# Altium schematic sheet configuration.SchDoc
size A4
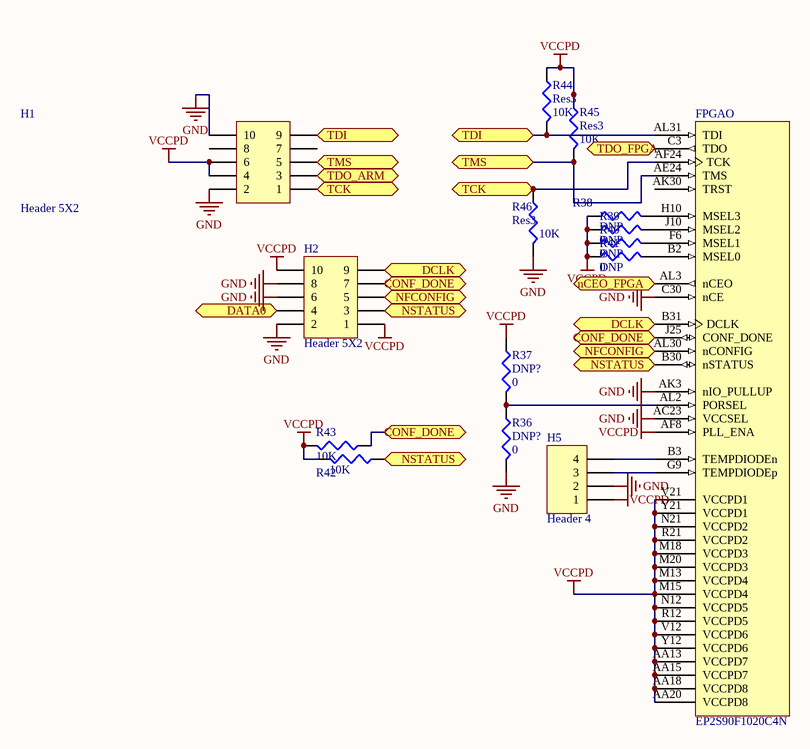
[diagram p0: configuration.SchDoc]

## Parts
FPGA  EP2S90F1020C4N  [FBGA1020]  (part O of 18)
H1  Header 5X2  [HDR2X5]
H2  Header 5X2  [HDR2X5]
H5  Header 4  [HDR1X4]
R36  DNP?  value 0  [RESC1608L]
R37  DNP?  value 0  [RESC1608L]
R38  DNP  value 0  [RESC1608L]
R39  DNP  value 0  [RESC1608L]
R40  DNP  value 0  [RESC1608L]
R41  DNP  value 0  [RESC1608L]
R42  value 10K  [RESC1608L]
R43  value 10K  [RESC1608L]
R44  Res3  value 10K  [RESC1608L]
R45  Res3  value 10K  [RESC1608L]
R46  Res3  value 10K  [RESC1608L]

## Ports
CONF_DONE, DATA0, DCLK, nCEO_FPGA, NFCONFIG, NSTATUS, TCK, TDI, TDO_ARM, TDO_FPGA, TMS

## Nets
GND: FPGA.AC23(VCCSEL) FPGA.AK3(nIO_PULLUP) FPGA.C30(nCE) H1.2 H1.10 H2.2 H2.6 H2.8 H5.2 R36.2 R46.2
VCCPD: FPGA.AA13(VCCPD7) FPGA.AA15(VCCPD7) FPGA.AA18(VCCPD8) FPGA.AA20(VCCPD8) FPGA.AF8(PLL_ENA) FPGA.M13(VCCPD4) FPGA.M15(VCCPD4) FPGA.M18(VCCPD3) FPGA.M20(VCCPD3) FPGA.N12(VCCPD5) FPGA.N21(VCCPD2) FPGA.R12(VCCPD5) FPGA.R21(VCCPD2) FPGA.V12(VCCPD6) FPGA.V21(VCCPD1) FPGA.Y12(VCCPD6) FPGA.Y21(VCCPD1) H1.4 H1.6 H2.1 H2.10 H5.1 R37.1 R38.1 R39.1 R40.1 R41.1 R42.2 R43.2 R44.1 R45.1
CONF_DONE: FPGA.J25(CONF_DONE) H2.7 R43.1 ; port CONF_DONE
DATA0: H2.4 ; port DATA0
DCLK: FPGA.B31(DCLK) H2.9 ; port DCLK
nCEO_FPGA: FPGA.AL3(nCEO) ; port nCEO_FPGA
NFCONFIG: FPGA.AL30(nCONFIG) H2.5 ; port NFCONFIG
NSTATUS: FPGA.B30(nSTATUS) H2.3 R42.1 ; port NSTATUS
TCK: FPGA.AF24(TCK) H1.1 R46.1 ; port TCK
TDI: FPGA.AL31(TDI) H1.9 R44.2 ; port TDI
TDO_ARM: H1.3 ; port TDO_ARM
TDO_FPGA: FPGA.C3(TDO) ; port TDO_FPGA
TMS: FPGA.AE24(TMS) H1.5 R45.2 ; port TMS
NetFPGA_AL2: FPGA.AL2(PORSEL) R36.1 R37.2
NetFPGA_B2: FPGA.B2(MSEL0) R41.2
NetFPGA_B3: FPGA.B3(TEMPDIODEn) H5.4
NetFPGA_F6: FPGA.F6(MSEL1) R40.2
NetFPGA_G9: FPGA.G9(TEMPDIODEp) H5.3
NetFPGA_H10: FPGA.H10(MSEL3) R38.2
NetFPGA_J10: FPGA.J10(MSEL2) R39.2

Not connected (* = marked no-connect by the designer): FPGA AK30(TRST); H1 7 8

## Library data of the parts
FPGA = EP2S90F1020C4N: Stratix II 1.2V FPGA, 758 I/Os, 1020-Pin FineLine BGA, Speed Grade 4, Commercial Grade, Pb-Free; Note: DQS signal pins in banks 3, 4, 7 & 8 named according to DQ bus modes. "/" separates each mode. ie. Mode x4, x8/x9, x16/x18 and x32/x36.; Published: 8-Jul-2005; LatestRevisionDate: 13-Apr-2006; LatestRevisionNote: IPC-7351 Footprint Added.; DatasheetVersion: ver4.3, Jan-2008; PackageVersion: ver15.1, May-2008; PackageReference: FBGA1020; Publisher: Altium Limited; PackageDescription: 1020-Ball FineLine Ball Grid Array (FBGA1020) - Flip Chip; Code_JEDEC: MS-034-AAP-1; ComponentLink1Description: Manufacturer Link; ComponentLink1URL: http://www.altera.com/products/devices/stratix2/st2-index.jsp; ComponentLink2Description: Handbook; ComponentLink2URL: http://www.altera.com/literature/hb/stx2/stratix2_handbook.pdf; ComponentLink3Description: Packaging Specification; ComponentLink3URL: http://www.altera.com/literature/ds/dspkg.pdf
H1 H2 = Header 5X2: Header, 5-Pin, Dual row; LatestRevisionDate: 17-Jul-2002; LatestRevisionNote: Re-released for DXP Platform.; Publisher: Altium Limited
H5 = Header 4: Header, 4-Pin; LatestRevisionDate: 17-Jul-2002; LatestRevisionNote: Re-released for DXP Platform.; Publisher: Altium Limited
R36-R46 = Res3: Resistor; Published: 8-Jun-2000; LatestRevisionDate: 29-May-2009; LatestRevisionNote: IPC-7351 Footprint Added.; PackageReference: J1-0603; Publisher: Altium Limited; PackageDescription: Chip Resistor